# Altium schematic sheet eth_part.SchDoc
size A3
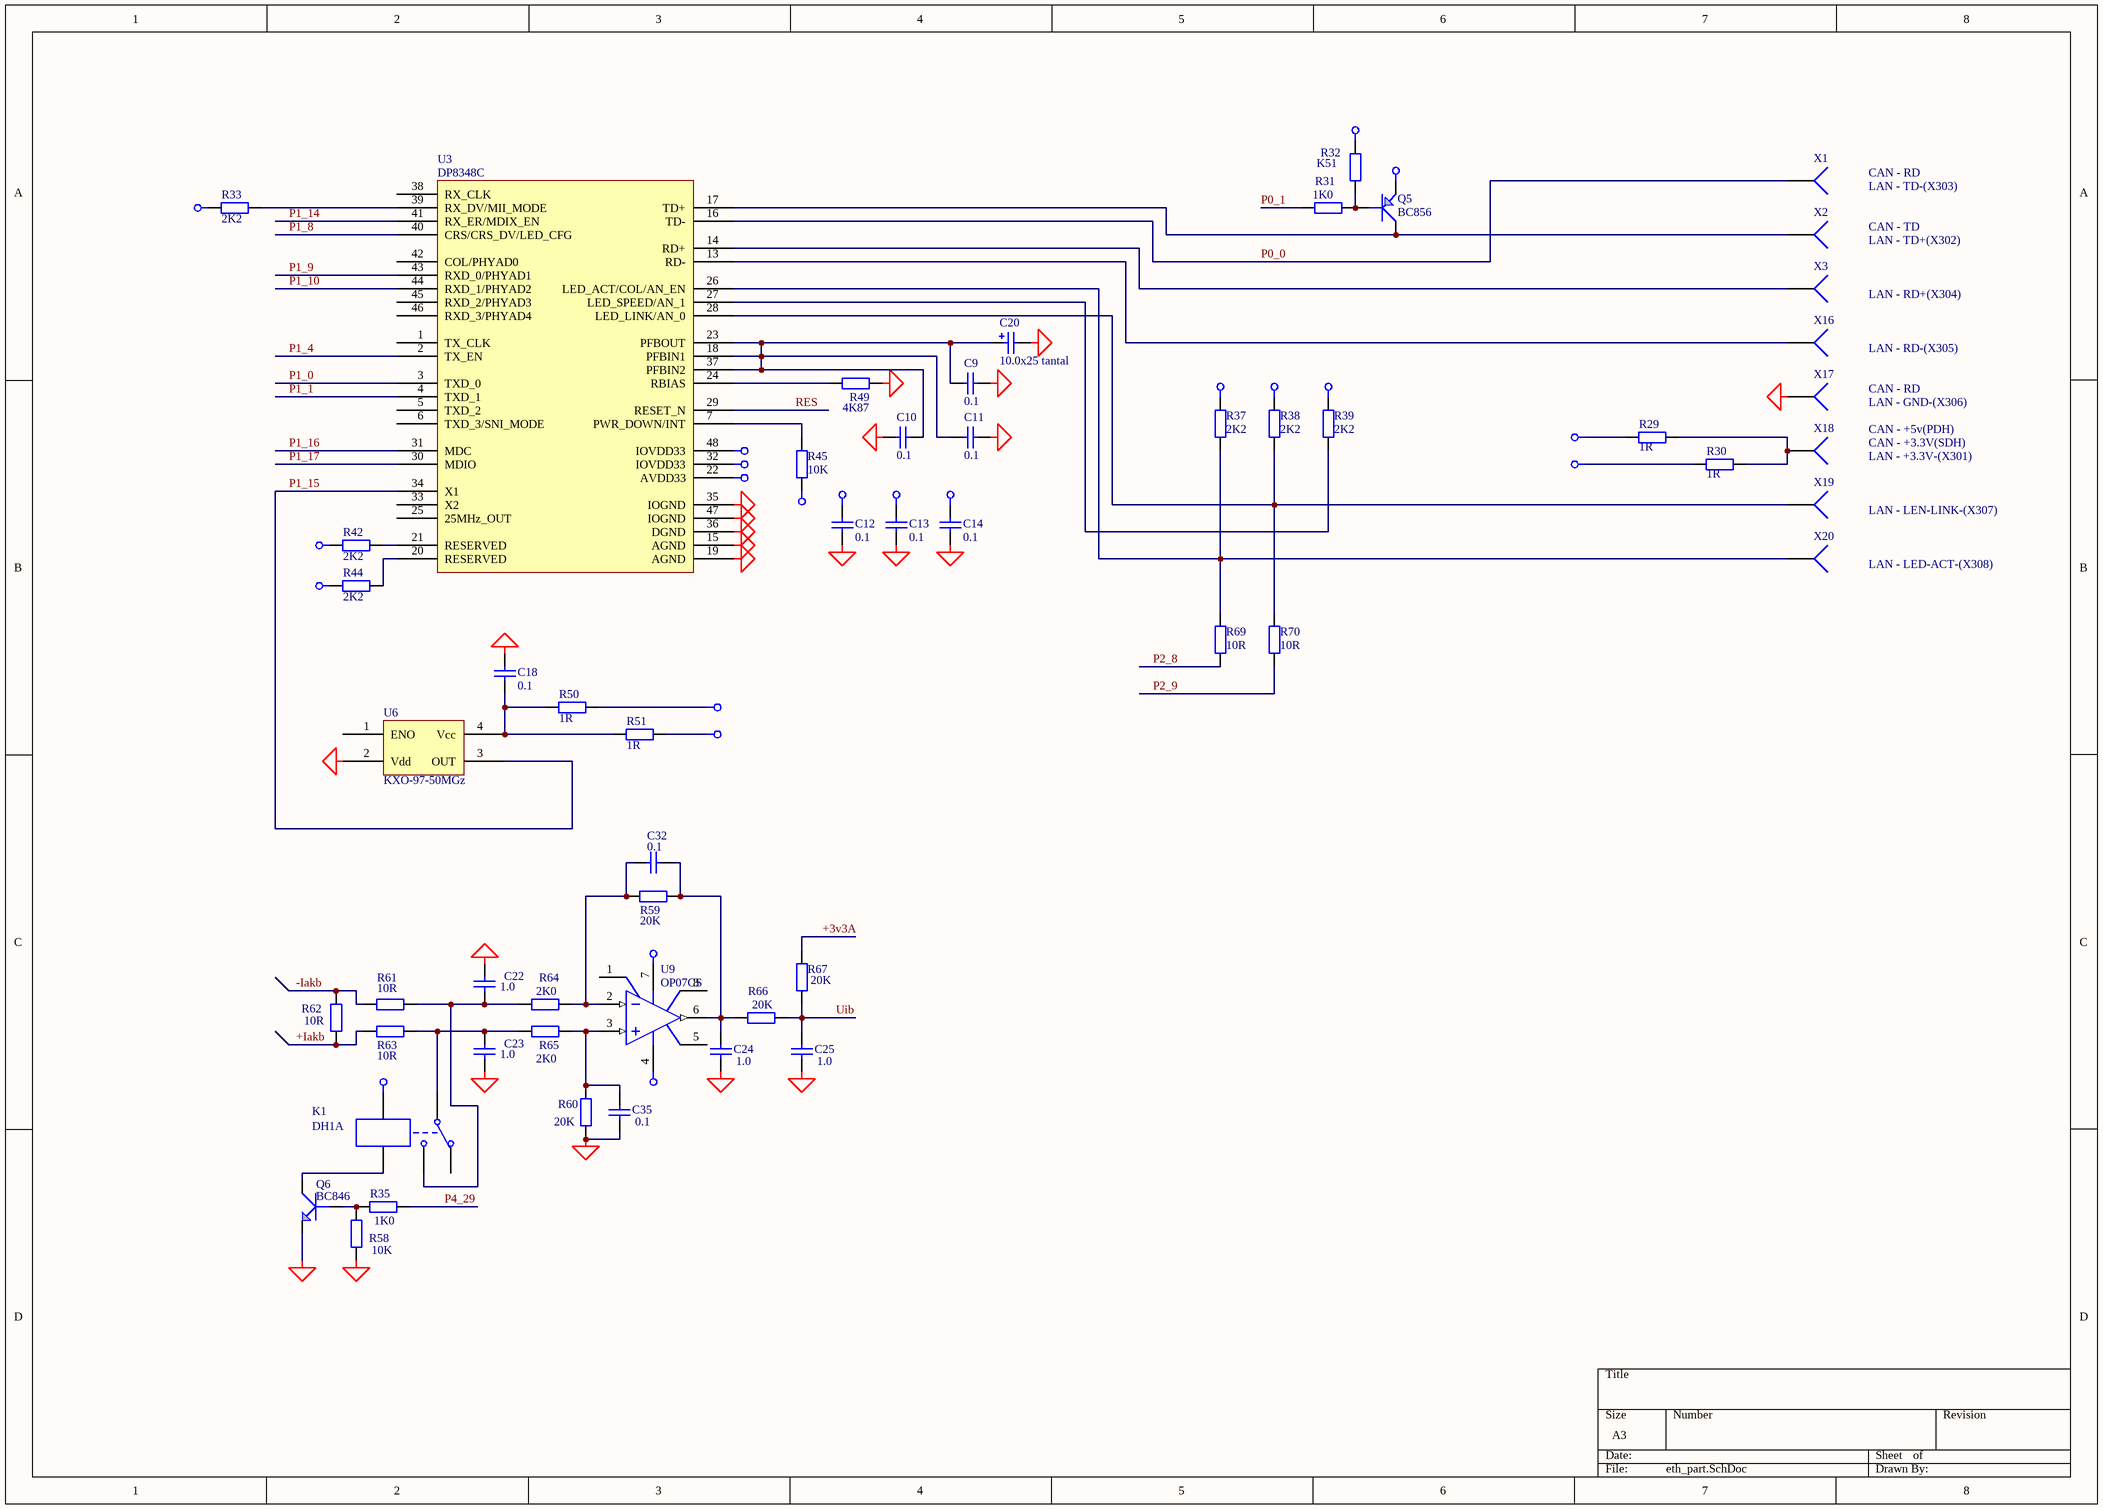
[diagram p0: eth_part.SchDoc]

## Parts
C9  0.1  [C3216-1206]
C10  0.1  [C3216-1206]
C11  0.1  [C3216-1206]
C12  0.1  [_1206]
C13  0.1  [_1206]
C14  0.1  [_1206]
C18  0.1  [_1206]
C20  10.0x25 tantal  [CAP_EL_6_3]
C22  1.0  [_1206]
C23  1.0  [_1206]
C24  1.0  [_1206]
C25  1.0  [_1206]
C32  0.1  [_1206]
C35  0.1  [_1206]
K1  DH1A  [kuan]
Q5  BC856  [SO-G3]
Q6  BC846  [SO-G3]
R29  1R  [_1206]
R30  1R  [_1206]
R31  1K0  [_1206]
R32  K51  [_1206]
R33  2K2  [_1206]
R35  1K0  [_1206]
R37  2K2  [_1206]
R38  2K2  [_1206]
R39  2K2  [_1206]
R42  2K2  [_1206]
R44  2K2  [_1206]
R45  10K  [_1206]
R49  4K87  [_1206]
R50  1R  [_1206]
R51  1R  [_1206]
R58  10K  [_1206]
R59  20K  [_1206]
R60  20K  [_1206]
R61  10R  [_1206]
R62  10R  [_1206]
R63  10R  [_1206]
R64  2K0  [_1206]
R65  2K0  [_1206]
R66  20K  [_1206]
R67  20K  [_1206]
R69  10R  [_1206]
R70  10R  [_1206]
U3  DP8348C  [F-QFP7X7-G48/N]
U6  KXO-97-50MGz  [KXO-97]
U9  OP07CS  [SO-G8]
X1  (no value)  [PIN1]
X2  (no value)  [PIN1]
X3  (no value)  [PIN1]
X16  (no value)  [PIN1]
X17  (no value)  [PIN1]
X18  (no value)  [PIN1]
X19  (no value)  [PIN1]
X20  (no value)  [PIN1]

## Nets
+3v3: C12.1 C13.1 C14.1 Q5.2(E) R29.2 R32.2 R33.2 R37.2 R38.2 R39.2 R42.2 R44.2 R45.2 R51.2 U3.22(AVDD33) U3.32(IOVDD33) U3.48(IOVDD33)
+5v: K1.4 R30.2 R50.2 U9.7(V+)
-5v: U9.4(V-)
GND: C9.2 C10.2 C11.2 C12.2 C13.2 C14.2 C18.2 C20.2 C22.1 C23.2 C24.1 C25.1 C35.2 Q6.2(E) R49.1 R58.1 R60.1 U3.15(AGND) U3.19(AGND) U3.35(IOGND) U3.36(DGND) U3.47(IOGND) U6.2(Vdd) X17.1
+3v3A: R67.2
+Iakb: R62.1 R63.2
-Iakb: R61.2 R62.2
P0_0: U3.16(TD-) X1.1
P0_1: R31.2
P1_0: U3.3(TXD_0)
P1_1: U3.4(TXD_1)
P1_4: U3.2(TX_EN)
P1_8: U3.40(CRS/CRS_DV/LED_CFG)
P1_9: U3.43(RXD_0/PHYAD1)
P1_10: U3.44(RXD_1/PHYAD2)
P1_14: U3.41(RX_ER/MDIX_EN)
P1_15: U3.34(X1) U6.3(OUT)
P1_16: U3.31(MDC)
P1_17: U3.30(MDIO)
P2_8: R69.1
P2_9: R70.1
P4_29: R35.1
RES: U3.29(RESET_N)
Uib: C25.2 R66.2 R67.1
NetC9_1: C9.1 C10.1 C11.1 C20.1 U3.18(PFBIN1) U3.23(PFBOUT) U3.37(PFBIN2)
NetC18_1: C18.1 R50.1 R51.1 U6.4(Vcc)
NetC22_2: C22.2 K1.3 R61.1 R64.1
NetC23_1: C23.1 K1.1 R63.1 R65.1
NetC24_2: C24.2 C32.2 R59.1 R66.1 U9.6(OUT)
NetC32_1: C32.1 R59.2 R64.2 U9.2(IN-)
NetC35_1: C35.1 R60.2 R65.2 U9.3(IN+)
NetK1_5: K1.5 Q6.3(C)
NetQ5_1: Q5.1(B) R31.1 R32.1
NetQ5_3: Q5.3(C) U3.17(TD+) X2.1
NetQ6_1: Q6.1(B) R35.2 R58.2
NetR29_1: R29.1 R30.1 X18.1
NetR33_1: R33.1 U3.39(RX_DV/MII_MODE)
NetR37_1: R37.1 R69.2 U3.26(LED_ACT/COL/AN_EN) X20.1
NetR38_1: R38.1 R70.2 U3.28(LED_LINK/AN_0) X19.1
NetR39_1: R39.1 U3.27(LED_SPEED/AN_1)
NetR42_1: R42.1 U3.21(RESERVED)
NetR44_1: R44.1 U3.20(RESERVED)
NetR45_1: R45.1 U3.7(PWR_DOWN/INT)
NetR49_2: R49.2 U3.24(RBIAS)
NetU3_13: U3.13(RD-) X16.1
NetU3_14: U3.14(RD+) X3.1

Not connected (* = marked no-connect by the designer): K1 2; U3 1(TX_CLK) 5(TXD_2) 6(TXD_3/SNI_MODE) 25(25MHz_OUT) 33(X2) 38(RX_CLK) 42(COL/PHYAD0) 45(RXD_2/PHYAD3) 46(RXD_3/PHYAD4); U6 1(ENO); U9 1(VOSTRIM) 5(NC) 8(VOSTRIM)

## Notes on the sheet
- CAN - RD
- CAN - TD
- LAN - TD+(X302)
- LAN - TD-(X303)
- LAN - RD+(X304)
- LAN - RD-(X305)
- LAN - GND-(X306)
- CAN - +3.3V(SDH)
- CAN - +5v(PDH)
- LAN - LEN-LINK-(X307)
- LAN - +3.3V-(X301)
- LAN - LED-ACT-(X308)

## Library data of the parts
C9-C14 C18 C22-C25 = Cap Semi: Capacitor (Semiconductor SIM Model); Manufacturer: Generic Components; Class I: Passive; Value: 1,0; Published: 8-Jun-2000; Revision: July-2002: Re-released for DXP Platform.; Publisher: Altium Limited; Class II: Capacitor
C20 = Cap Pol1: Polarized Capacitor (Radial); Manufacturer: Generic Components; Class I: Passive; Value: 10,0x25; Published: 8-Jun-2000; Revision: July-2002: Re-released for DXP Platform.; Publisher: Altium Limited; Class II: Capacitor
C32 C35 = Cap Semi: Capacitor (Semiconductor SIM Model); Manufacturer: Generic Components; Class I: Passive; Value: 0,1; Published: 8-Jun-2000; Revision: July-2002: Re-released for DXP Platform.; Publisher: Altium Limited; Class II: Capacitor
K1 = BS115: Single-Pole Dual-Throw Relay; Manufacturer: Generic Components; Class I: Electro-mechanical; Published: 24-Mar-1999; Revision: July-2002: Re-released for DXP Platform.; Publisher: Altium Limited; Class II: Relay
Q5 = GT109: Right: 20; Bottom: 20
Q6 = GT122: Right: 20; Bottom: 20
R29 R30 R33 R37-R39 R42 R44 R49-R51 R69 R70 = Res2: Resistor; Manufacturer: Generic Components; Class I: Passive; Value: 10K; Rule: Undefined; Published: 8-Jun-2000; Revision: July-2002: Re-released for DXP Platform.; Publisher: Altium Limited; Class II: Resistor
R31 = Res2: Resistor; Manufacturer: Generic Components; Class I: Passive; Value: 1K; Rule: Undefined; Published: 8-Jun-2000; Revision: July-2002: Re-released for DXP Platform.; Publisher: Altium Limited; Class II: Resistor
R32 R35 R45 R61-R63 = Res2: Resistor; Manufacturer: Generic Components; Class I: Passive; Rule: Undefined; Published: 8-Jun-2000; Revision: July-2002: Re-released for DXP Platform.; Publisher: Altium Limited; Class II: Resistor
  R32: Value: K51
  R35: Value: 1K0
  R45: Value: 10K
  R61-R63: Value: 10R
R58-R60 R64-R67 = Res2: Resistor; Manufacturer: Generic Components; Class I: Passive; Published: 8-Jun-2000; Revision: July-2002: Re-released for DXP Platform.; Publisher: Altium Limited; Class II: Resistor
  R58: Value: 10K
  R59 R60 R66 R67: Value: 20K
  R64 R65: Value: 2K0
U6 = KXO-97
U9 = OP07CS: Ultra-Low Offset Voltage Operational Amplifier; Manufacturer: Analog Devices; Note: Pin 5 is not connected.; Published: 8-Jun-2000; Revision: July-2002: Re-released for DXP Platform.; Datasheet: Designer's Reference Manual CD (1992); Package Reference: SO-8B; Publisher: Altium Limited; Class I: Amplifier; Class II: Operational Amplifier
X1-X3 X16-X20 = Socket: Manufacturer: Generic Components; Class I: Connector; Revision: July-2002: Re-released for DXP Platform.; Publisher: Altium Limited